# EAGLE design Feuchte-Relais-mit-LCD_v2 (EAGLE 7.4.0)
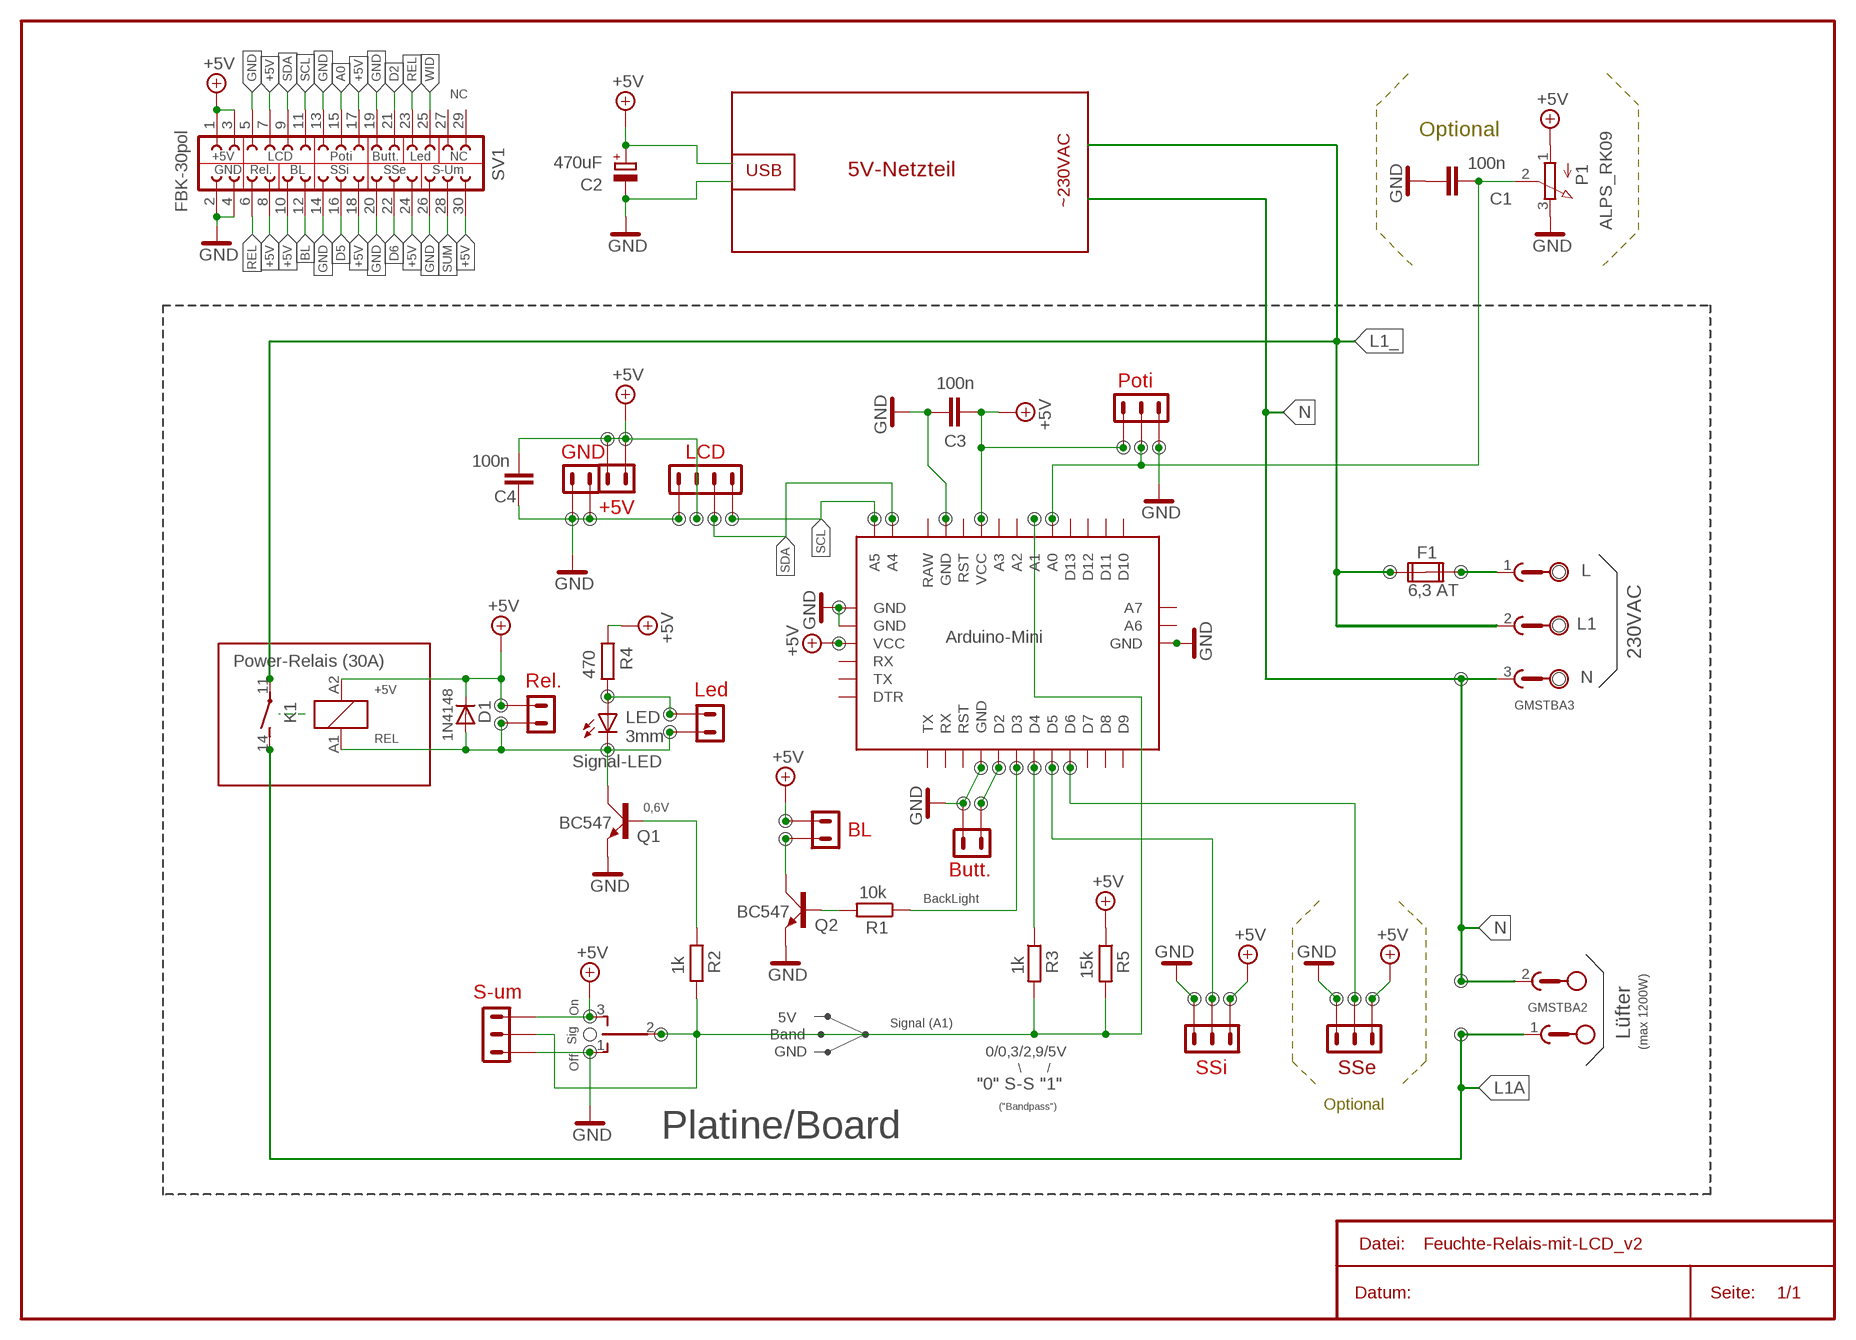
[diagram p0: schematic, sheet 1]

## Parts
230VAC  GMSTBA3  [GMSTBA3]
BOARD  Arduino-Mini  ARDU-MINI  [ARDU-MINI]
C1  100n  C-EU025-024X044  [C025-024X044]
C2  470uF  CPOL-EUE3.5-8  [E3,5-8]
C3  100n  C-EU025-024X044  [C025-024X044]
C4  100n  C-EU025-024X044  [C025-024X044]
D1  1N4148  DIODE-D-2.5  [D-2.5]
F1  6,3 AT  FUSE2P  [FUSE1]
K1  Power-Relais (30A)  ZD322006  [ZD2]
LED1  o3mm  LED3MM  [LED3MM]
LüFTER  GMSTBA2  [GMSTBA2]
P1  ALPS_RK09  [RK09]
Q1  BC547  [SOT54A]
Q2  BC547  [SOT54A]
R1  10k  R-EU_0204/7  [0204/7]
R2  1k  R-EU_0204/2V  [0204V]
R3  1k  R-EU_0204/2V  [0204V]
R4  470  R-EU_0204/2V  [0204V]
R5  15k  R-EU_0204/2V  [0204V]
SUM  TL39PO  [TL3XPO]
SV1  FBK-30pol  FE15-2  [FE15-2]

## Nets
+5V: BOARD.P$21(VCC) BOARD.P$27(VCC) C2.+ C3.1 C4.2 D1.C K1.A2 P1.1(A) R4.1 R5.1 SUM.3(S) SV1.1 SV1.3 SV1.7 SV1.8 SV1.10 SV1.17 SV1.18 SV1.24 SV1.30
A0: BOARD.P$17(A0) C1.2 P1.2(S) SV1.15
A1: BOARD.P$18(A1) R2.1 R3.2 R5.2 SUM.2(P)
BL: Q2.C SV1.12
D2: BOARD.P$5(D2) SV1.21
D3: BOARD.P$6(D3) R1.1
D4: BOARD.P$7(D4) R3.1
D5: BOARD.P$8(D5) SV1.16
D6: BOARD.P$9(D6) SV1.22
GND: BOARD.P$4(GND) BOARD.P$23(GND) BOARD.P$25(GND) BOARD.P$26(GND) BOARD.P$31(GND) C1.1 C2.- C3.2 C4.1 P1.3(E) Q1.E Q2.E SUM.1(O) SV1.2 SV1.4 SV1.5 SV1.13 SV1.14 SV1.19 SV1.20 SV1.26
L: 230VAC.1 F1.2A
L1_: 230VAC.2 F1.1A K1.11(2:P)
L1A: K1.14(2:S) LüFTER.1
N: 230VAC.3 LüFTER.2
N$2: Q1.B R2.2
N$9: Q2.B R1.2
REL: D1.A K1.A1 LED1.K(C) Q1.C SV1.6 SV1.23
SCL: BOARD.P$35(A5) SV1.11
SDA: BOARD.P$34(A4) SV1.9
SUM: SV1.28
WID: LED1.A R4.2 SV1.25
Unconnected: BOARD.P$1(TX) BOARD.P$2(RX) BOARD.P$3(RST) BOARD.P$10(D7) BOARD.P$11(D8) BOARD.P$12(D9) BOARD.P$13(D10) BOARD.P$14(D11) BOARD.P$15(D12) BOARD.P$16(D13) BOARD.P$19(A2) BOARD.P$20(A3) BOARD.P$22(RST) BOARD.P$24(RAW) BOARD.P$28(RX) BOARD.P$29(TX) BOARD.P$30(DTR) BOARD.P$32(A6) BOARD.P$33(A7) F1.1B F1.2B SV1.27 SV1.29

## Notes on the sheet
- NC
- Optional
- +5V | LCD | Poti | Butt. | Led | NC
- GND | Rel. | BL | SSi | SSe | S-Um | USB | 5V-Netzteil
- ~230VAC
- Poti
- GND | LCD
- +5V
- L
- L1
- 230VAC
- Rel. | N
- +5V | Led
- LED
  3mm
- REL
- Signal-LED
- 0,6V
- BL
- Butt.
- BackLight
- S-um
- On
- Signal (A1)
- Lüfter
- Sig
- (max 1200W)
- 5V
  Band
   GND
- 0/0,3/2,9/5V
- Off | SSi | SSe
- "0" S-S "1"
- ("Bandpass") | Optional
- Platine/Board

## Library data of the parts
230VAC = con-phoenix-762:GMSTBA3: PHOENIX; MF: FARNELL; MPN: 1757255; OC_FARNELL: 3705183; OC_NEWARK: 71C4162
BOARD = Arduino-AVR:ARDU-MINI: Arduino Mini Pro Atmega328P Board Modul • Size: (LxWxH) 33x18x3 mm • ATmega328 running at 16MHz with external resonator (0.5% tolerance) • USB connection off board • Supports auto-reset • Max 150mA output • Over current protected • Reverse polarity protected • DC input 5V up to 12V • On board Power and Status LEDs
C1 C3 C4 = rcl1:C-EU: CAPACITOR, European symbol
C2 = rcl1:CPOL-EU: POLARIZED CAPACITOR, European symbol
D1 = diode1:DIODE-: DIODE
F1 = special:FUSE2P: FUSE 5 x 20 mm
K1 = relay:ZD?2*: Power Relay SCHRACK 1 pole 30 A Source: http://www.schrack.com/.. 5848.pdf; OC_FARNELL: unknown; OC_NEWARK: unknown
LED1 = led:LED: LED OSRAM: - CHIPLED LG R971, LG N971, LY N971, LG Q971, LY Q971, LO R971, LY R971 LH N974, LH R974 LS Q976, LO Q976, LY Q976 LO Q996 - Hyper CHIPLED LW Q18S LB Q993, LB Q99A, LB R99A - SideLED LS A670, LO A670, LY A670, LG A670, LP A670 LB A673, LV A673, LT A673, LW A673 LH A674 LY A675 LS A676, LA A676, LO A676, LY A676, LW A676 LS A679, LY A679, LG A679 - Hyper Micro SIDELED® LS Y876, LA Y876, LO Y876, LY Y876 LT Y87S - SmartLED LW L88C, LW L88S LB L89C, LB L89S, LG L890 LS L89K, LO L89K, LY L89K LS L896, LA L896, LO L896, LY L896 - TOPLED LS T670, LO T670, LY T670, LG T670, LP T670 LSG T670, LSP T670, LSY T670, LOP T670, LYG T670 LG T671, LOG T671, LSG T671 LB T673, LV T673, LT T673, LW T673 LH T674 LS T676, LA T676, LO T676, LY T676, LB T676, LH T676, LSB T676, LW T676 LB T67C, LV T67C, LT T67C, LS T67K, LO T67K, LY T67K, LW E67C LS E67B, LA E67B, LO E67B, LY E67B, LB E67C, LV E67C, LT E67C LW T67C LS T679, LY T679, LG T679 LS T770, LO T770, LY T770, LG T770, LP T770 LB T773, LV T773, LT T773, LW T773 LH T774 LS E675, LA E675, LY E675, LS T675 LS T776, LA T776, LO T776, LY T776, LB T776 LHGB T686 LT T68C, LB T68C - Hyper Mini TOPLED® LB M676 - Mini TOPLED Santana® LG M470 LS M47K, LO M47K, LY M47K Source: http://www.osram.convergy.de LUXEON: - LUMILED® LXK2-PW12-R00, LXK2-PW12-S00, LXK2-PW14-U00, LXK2-PW14-V00 LXK2-PM12-R00, LXK2-PM12-S00, LXK2-PM14-U00 LXK2-PE12-Q00, LXK2-PE12-R00, LXK2-PE12-S00, LXK2-PE14-T00, LXK2-PE14-U00 LXK2-PB12-K00, LXK2-PB12-L00, LXK2-PB12-M00, LXK2-PB14-N00, LXK2-PB14-P00, LXK2-PB14-Q00 LXK2-PR12-L00, LXK2-PR12-M00, LXK2-PR14-Q00, LXK2-PR14-R00 LXK2-PD12-Q00, LXK2-PD12-R00, LXK2-PD12-S00 LXK2-PH12-R00, LXK2-PH12-S00 LXK2-PL12-P00, LXK2-PL12-Q00, LXK2-PL12-R00 Source: www.luxeon.com KINGBRIGHT: KA-3528ASYC Source: www.kingbright.com
LüFTER = con-phoenix-762:GMSTBA2: PHOENIX; MF: FARNELL; MPN: 1757242; OC_FARNELL: 3705171; OC_NEWARK: 71C4161
P1 = pot:ALPS_RK09: ALPS Drehpotentiometer "RK09 Series" TH-Montage senkrecht auf der Platine, Maße: 10x11mm, ø6mm * L:17,4mm Farnell-Nr: 1191725 (10k-Poti)
Q1 Q2 = transistor-small-signal:BC547: NPN TRANSISTOR
R1-R5 = rcl1:R-EU_: RESISTOR, European symbol
SUM = switch:TL39PO: TINY SWITCH ON OFF ON Source: http://www2.produktinfo.conrad.com/datenblaetter/700000-724999/705152-da-01-de-Subminiaturschalter_TL_36YO.pdf
SV1 = con-lsta:FE15-2: FEMALE HEADER; OC_FARNELL: unknown; OC_NEWARK: unknown

## Board
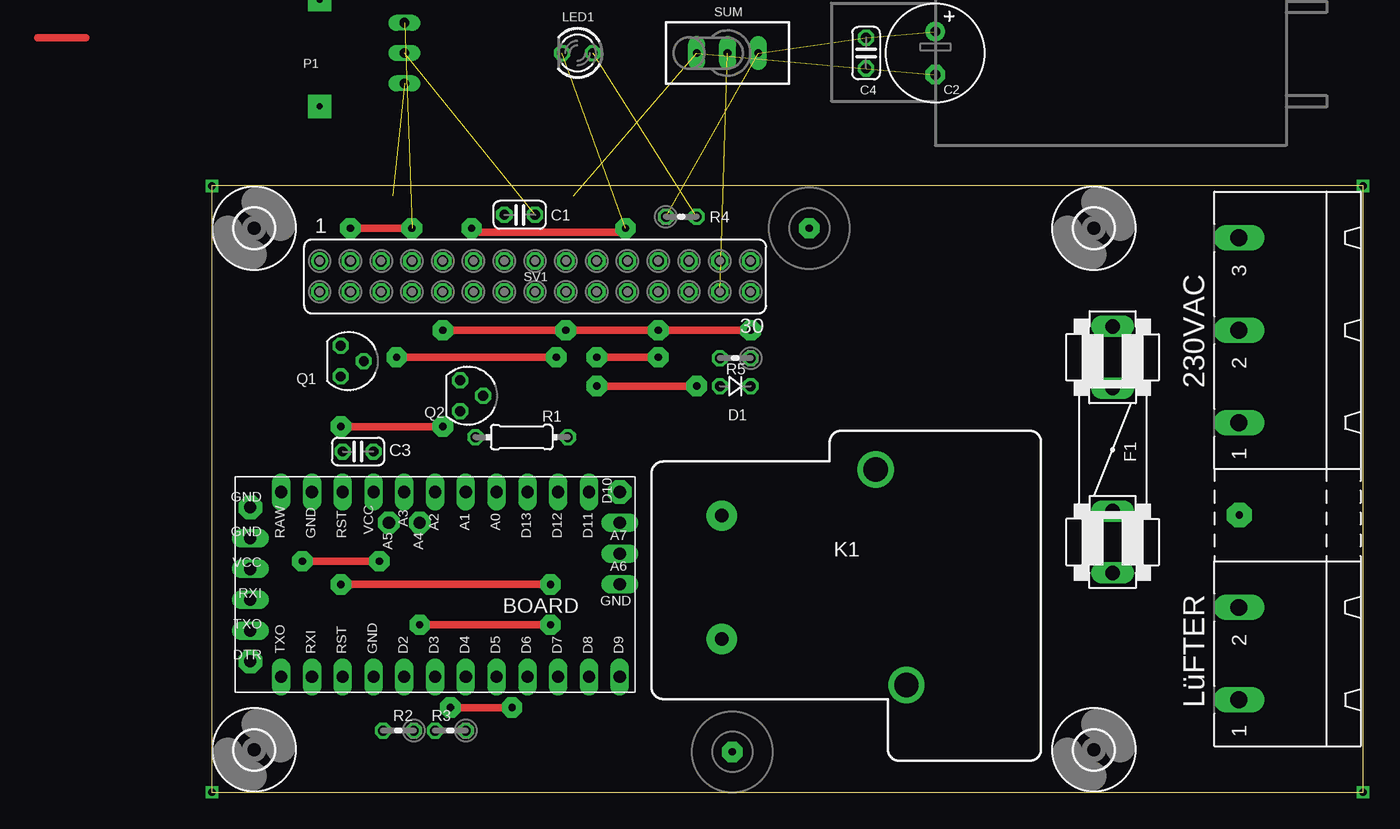
[diagram p1: board, top side]
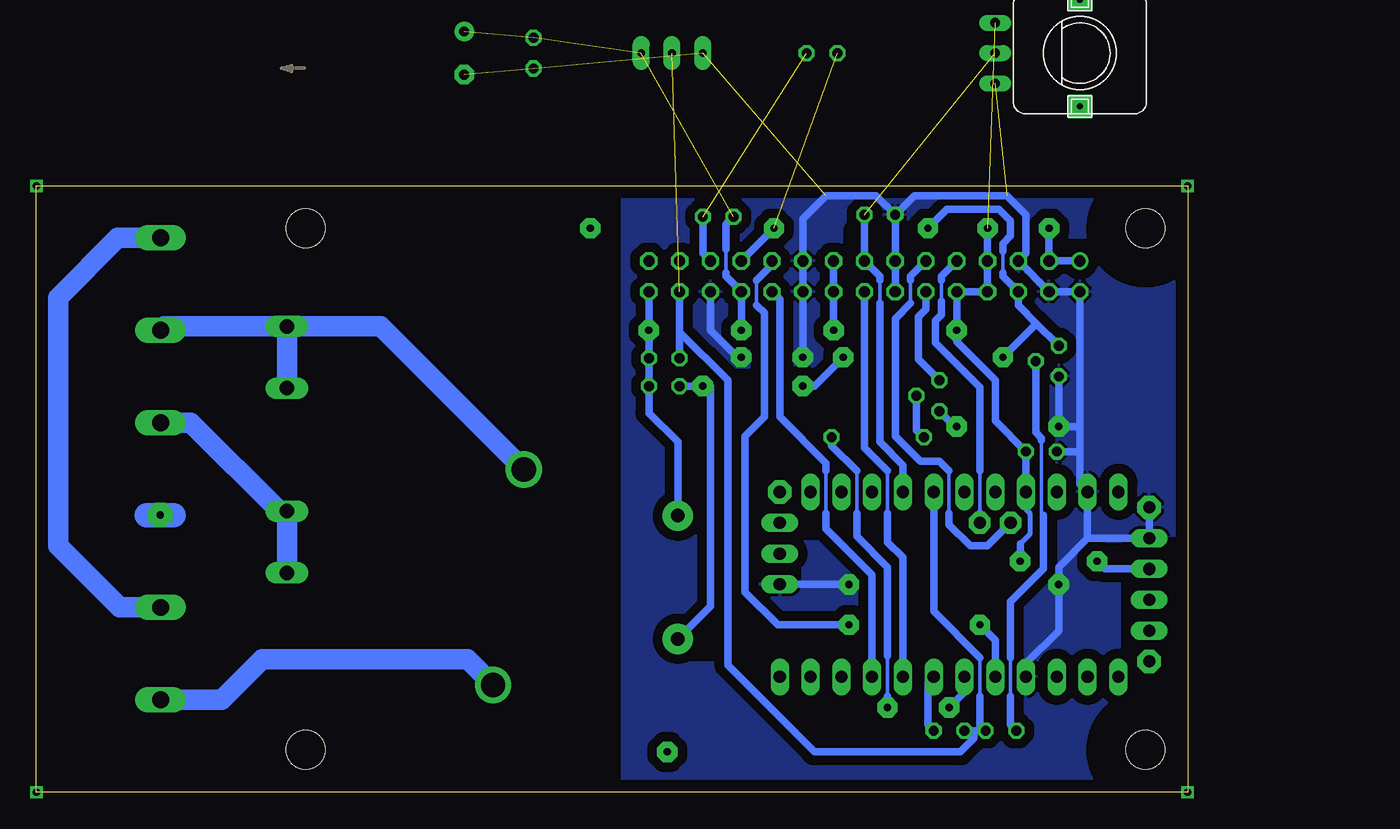
[diagram p2: board, bottom side, seen from below]

Size 95 x 50 mm. Coordinates in mm from the lower left corner, seen from the top.
Outline: 0,0 95,0 95,50 0,50 0,0
Copper layers (1*16): Top 0.035mm / dielectric 1.5mm / Bottom 0.035mm
Design rules "default": minimum track width 10mil, minimum drill 24mil, track to track 8mil, track to pad 8mil, pad to pad 8mil, via to via 8mil, smd to smd 8mil, copper to edge 40mil, drill to drill 8mil, minimum pad ring 10mil, minimum via ring 8mil, stop-mask expansion 4mil, vias tented up to drill 0mil, thermal gap 10mil
bRestrict: area 18.1,27.4 to 21.2,33.6; area 22,43.2 to 27.6,46.4; area 0.8,11 to 4.7,20.2; area 30,21.6 to 32.5,22.9; area 8.1,44.1 to 14.2,44.9; area 38,11.6 to 42,13.7; area 36.2,32.3 to 37.4,34.1; area 4.5,18.4 to 6.9,19.8; area 32.7,17.5 to 34.1,20

### Footprints (pad centres in the part's own frame; a part is rotated, then mirrored left to right if it is on the bottom)
GMSTBA3 = drill 1.397 long: 1 -7.62,5.08; 2 0,5.08; 3 7.62,5.08
ARDU-MINI = drill 1 pad 1.524 long: P$1 -6.35,11.43; P$2 -6.35,8.89; P$3 -6.35,6.35; P$4 -6.35,3.81; P$5 -6.35,1.27; P$6 -6.35,-1.27; P$7 -6.35,-3.81; P$8 -6.35,-6.35; P$9 -6.35,-8.89; P$10 -6.35,-11.43; P$11 -6.35,-13.97; P$12 -6.35,-16.51; P$14 8.89,-13.97; P$15 8.89,-11.43; P$16 8.89,-8.89; P$17 8.89,-6.35; P$18 8.89,-3.81; P$19 8.89,-1.27; P$20 8.89,1.27; P$21 8.89,3.81; P$22 8.89,6.35; P$23 8.89,8.89; P$24 8.89,11.43; P$26 5.08,13.97; P$27 2.54,13.97; P$28 0,13.97; P$29 -2.54,13.97; P$31 1.27,-16.51; P$32 3.81,-16.51; P$33 6.35,-16.51 | drill 1 pad 1.93 octagon: P$13 8.89,-16.51; P$25 7.62,13.97; P$30 -5.08,13.97 | drill 1 pad 1.778 octagon: P$34 6.35,0; P$35 6.35,2.54
C025-024X044 = drill 0.813 octagon: 1 -1.27,0; 2 1.27,0
E3,5-8 = drill 0.813 pad 1.6: + -1.778,0 | drill 0.813 pad 1.6 octagon: - 1.778,0
D-2.5 = drill 0.813 octagon: A 1.27,0; C -1.27,0
FUSE1 = drill 1.194 long: 1A -10.16,0; 1B -5.08,0; 2A 10.16,0; 2B 5.08,0
ZD2 = drill 2 pad 2.5: 11 -2.54,-8.88; 14 -5.08,8.88 | drill 1.1 pad 2.5: A1 10.16,5.08; A2 10.16,-5.08
LED3MM = drill 0.813 octagon: A -1.27,0; K 1.27,0
GMSTBA2 = drill 1.397 long: 1 -3.81,5.08; 2 3.81,5.08
RK09 = drill 0.8 long: 1 -2.5,-7; 2 0,-7; 3 2.5,-7 | drill 0.5 pad 1.93 square: GND@1 -4.4,0; GND@2 4.4,0
SOT54A = drill 0.813 octagon: B 0,1.27; C -1.27,-0.635; E 1.27,-0.635
0204/7 = drill 0.813 octagon: 1 -3.81,0; 2 3.81,0
0204V = drill 0.813 octagon: 1 -1.27,0; 2 1.27,0
TL3XPO = drill 0.635 pad 1.422 long: 1 -2.54,0; 2 0,0; 3 2.54,0
FE15-2 = drill 0.914: 1 -17.78,1.27 | drill 0.914 octagon: 2 -17.78,-1.27; 3 -15.24,1.27; 4 -15.24,-1.27; 5 -12.7,1.27; 6 -12.7,-1.27; 7 -10.16,1.27; 8 -10.16,-1.27; 9 -7.62,1.27; 10 -7.62,-1.27; 11 -5.08,1.27; 12 -5.08,-1.27; 13 -2.54,1.27; 14 -2.54,-1.27; 15 0,1.27; 16 0,-1.27; 17 2.54,1.27; 18 2.54,-1.27; 19 5.08,1.27; 20 5.08,-1.27; 21 7.62,1.27; 22 7.62,-1.27; 23 10.16,1.27; 24 10.16,-1.27; 25 12.7,1.27; 26 12.7,-1.27; 27 15.24,1.27; 28 15.24,-1.27; 29 17.78,1.27; 30 17.78,-1.27
3,2 = hole 3.2: 0,0

### Placement (x,y rotation side)
230VAC  89.82,38.1 90 top
BOARD  17.14,15.88 90 top
C1  25.4,47.62 0 top
C2  59.69,60.96 270 top  (outside the outline)
C3  12.06,28.1 180 top
C4  53.98,60.96 90 top  (outside the outline)
D1  43.18,33.5 180 top
F1  74.31,28.26 270 top
K1  52.23,17.73 180 top
LED1  30.16,60.96 180 top  (outside the outline)
LüFTER  89.82,11.43 90 top
P1  8.89,60.96 270 bottom  (outside the outline)
Q1  11.27,35.56 270 top
Q2  21.11,32.7 270 top
R1  25.56,29.29 180 top
R2  15.4,5.08 180 top
R3  19.68,5.08 180 top
R4  38.73,47.47 0 top
R5  43.18,35.8 180 top
SUM  42.55,60.96 0 top  (outside the outline)
SV1  26.67,42.55 0 top
U$1  [3,2]  72.77,3.49 0 top
U$2  [3,2]  72.77,46.51 0 top
U$3  [3,2]  3.49,46.51 0 top
U$4  [3,2]  3.49,3.49 0 top

### Tracks (layer width: path | path; a pad name or v marks a point on that pad's centre or on a via)
+5V  (via drill 0.6 pad 1.68)  (4 unrouted)
  Top 0.61: v11.43,46.51 v16.51,46.51 | v44.45,38.1 v36.83,38.1 v29.21,38.1 v19.05,38.1 | v13.81,19.05 v7.46,19.05
  Bottom 0.305: 38.1,44.77 38.1,42.86
  Bottom 0.406: BOARD.P$21 13.34,23.34 13.02,23.02 13.02,21.27 13.81,20.48
  Bottom 0.61: SV1.1 SV1.3 v11.43,46.51 | v16.51,46.51 SV1.7 SV1.8 SV1.10 v19.05,38.1 19.05,37.15 15.88,33.97 15.88,30.64 C3.1 BOARD.P$21 | SV1.30 v44.45,38.1 R5.1 D1.C 44.45,31.27 42.07,28.89 K1.A2 | v36.83,38.1 SV1.24 38.1,42.55 38.1,42.86 | SV1.17 SV1.18 v29.21,38.1 | R4.1 38.1,46.83 38.1,44.77 | 13.81,20.48 v13.81,19.05 | v7.46,19.05 6.83,18.41 BOARD.P$27
A0  (1 unrouted)
  Bottom 0.305: 25.4,42.23 25.4,40.32
  Bottom 0.61: 25.4,42.23 25.4,42.55 SV1.15 C1.2 | 25.4,40.32 25.4,28.89 23.5,26.99 BOARD.P$17
A1  (1 unrouted)
  Bottom 0.305: 17.14,7.94 17.14,11.11
  Bottom 0.61: 17.14,5.08 R2.1 | 17.14,11.11 20.95,14.92 BOARD.P$18 | 17.14,7.94 17.14,5.08 | 41.91,37.94 37.94,33.97 37.94,10.48 30.8,3.33 18.73,3.33 17.62,4.45 17.62,5.08 | 41.91,37.94 41.91,41.27 | 41.91,37.94 R5.2 | R3.2 17.62,5.08 | 17.62,5.08 17.14,5.08
BL
  Bottom 0.61: SV1.12 21.59,39.85 22.23,39.21 22.23,35.72 Q2.C
D2  (via drill 0.6 pad 1.68)
  Top 0.61: v17.14,13.81 v27.94,13.81
  Bottom 0.305: 35.56,40.16 35.56,42.23
  Bottom 0.61: BOARD.P$5 15.88,12.54 v17.14,13.81 | v27.94,13.81 33.81,13.81 36.51,16.51 36.51,29.37 34.92,30.96 34.92,39.53 35.56,40.16 | 35.56,42.23 34.29,43.5 SV1.21
D3  (via drill 0.6 pad 1.68)
  Top 0.61: v19.68,6.99 v24.77,6.99
  Bottom 0.305: 27.3,26.51 27.3,23.02 | 24.77,11.27 24.77,7.94
  Bottom 0.61: R1.1 29.37,28.57 27.3,26.51 | 27.3,23.02 27.3,21.11 24.77,18.57 24.77,11.27 | BOARD.P$6 18.41,8.26 v19.68,6.99 | 24.77,7.94 v24.77,6.99
D4
  Bottom 0.61: BOARD.P$7 21.43,9.05 21.43,5.56 R3.1
D5
  Bottom 0.305: 24.77,26.51 24.77,23.02
  Bottom 0.61: SV1.16 26.67,28.42 24.77,26.51 | 24.77,23.02 24.77,20.64 23.5,19.37 BOARD.P$8
D6
  Bottom 0.305: 29.84,23.02 29.84,26.51
  Bottom 0.61: BOARD.P$9 26.04,17.94 29.84,21.75 29.84,23.02 | 29.84,26.51 29.84,27.15 33.66,30.96 33.66,40.64 SV1.22
GND  (via drill 0.6 pad 1.68)  (4 unrouted)
  Top 0.61: v19.05,30.16 v10.64,30.16 | v36.83,35.88 v31.75,35.88 | v27.94,17.14 v10.64,17.14
  Bottom 0.61: 8.89,30.16 SV1.2 SV1.4 SV1.5 13.34,44.45 13.34,47.62 14.92,49.21 22.54,49.21 C1.1 | 8.89,30.16 8.89,28.1 | 8.89,28.1 8.89,25.4 BOARD.P$23 8.26,20.96 | SV1.14 SV1.13 C1.1 | C1.1 25.72,49.21 29.84,49.21 31.75,47.31 SV1.19 SV1.20 v31.75,35.88 | BOARD.P$25 BOARD.P$26 8.26,20.96 | C3.2 8.89,28.1 | 8.89,30.16 v10.64,30.16 Q1.E | v19.05,30.16 19.21,30.16 Q2.E | v36.83,35.88 37.15,35.88 39.37,38.1 SV1.26 | BOARD.P$4 13.34,10.64 10.64,13.34 v10.64,17.14 10.64,18.57 8.26,20.96 | BOARD.P$31 28.73,17.15 v27.94,17.14
  pour Bottom (isolate 0.813): -0.64,50.48 46.67,50.48 46.67,-0.64 -0.64,-0.64
L
  Bottom 1.676: F1.2A 74.31,23.16 74.93,23.18 82.23,30.48 230VAC.1
L1_
  Bottom 1.676: 230VAC.2 84.42,38.42 F1.1A | K1.11 66.57,38.42 F1.1A | F1.1A 74.31,33.34
L1A
  Bottom 1.676: LüFTER.1 79.69,7.62 76.36,10.95 59.41,10.95 K1.14
N
  Bottom 1.676: 230VAC.3 88.27,45.72 93.19,40.8 93.19,20.32 88.11,15.24 LüFTER.2
N$1  (via drill 0.6 pad 1.68)
  other vias: 3.49,46.51
N$2
  Bottom 0.305: 14.61,7.94 14.61,11.11 | 12.06,29.05 12.06,22.86 11.91,22.86
  Bottom 0.61: R2.2 14.61,5.56 14.61,7.94 | 14.61,11.11 14.61,15.72 11.91,18.41 11.91,22.86 | 12.06,29.05 12.06,29.21 12.54,29.69 Q1.B
N$3  (via drill 0.6)
  other vias: 0,0
N$4  (via drill 0.6 pad 1.68)
  other vias: 42.94,3.33
N$5  (via drill 0.6 pad 1.68)
  other vias: 3.49,3.49
N$6  (via drill 0.6 pad 1.68)
  other vias: 72.77,3.49
N$8  (via drill 0.6 pad 1.68)
  other vias: 49.29,46.51
N$9
  Bottom 0.61: Q2.B 22.38,29.84 R1.2
N$10  (via drill 0.6 pad 2.03)
  Bottom 2.032: 85.88,22.86 v84.77,22.86 83.66,22.86
N$11  (via drill 0.6)
  other vias: 0,50.01
N$12  (via drill 0.6)
  other vias: 94.98,50.01
N$13  (via drill 0.6)
  other vias: 94.98,0
N$14
  Top 0.61: -14.37,62.23 -10.4,62.23
N$19  (via drill 0.6 pad 1.68)
  other vias: 72.77,46.51
REL  (via drill 0.6 pad 1.68)  (1 unrouted)
  Top 0.61: v21.43,46.51 21.75,46.2 33.81,46.2 v34.13,46.51 | v28.42,35.88 v15.24,35.88 | v31.75,33.5 v40.01,33.5
  Bottom 0.305: 15.24,42.86 15.24,44.61
  Bottom 0.61: 15.24,42.86 15.24,42.55 SV1.6 13.97,40.16 12.46,38.66 | 15.24,44.61 15.24,45.24 14.61,45.88 14.61,47.15 15.56,48.1 19.84,48.1 v21.43,46.51 | v34.13,46.51 SV1.23 | 12.46,38.66 Q1.C | v15.24,35.88 12.46,38.66 | v28.42,35.88 30.8,33.5 v31.75,33.5 | K1.A1 39.37,15.35 39.37,33.5 v40.01,33.5 D1.A
SCL
  Bottom 0.305: 22.86,42.23 22.86,40.32 | 19.68,26.51 19.68,23.02
  Bottom 0.61: SV1.11 22.86,42.55 22.86,42.23 | 22.86,40.32 24.13,39.05 24.13,29.37 22.07,27.3 20.48,27.3 19.68,26.51 | 19.68,23.02 19.68,22.07 17.94,20.32 16.51,20.32 BOARD.P$35
SDA
  Bottom 0.305: 17.14,23.02 17.14,26.51 | 20.32,42.23 20.32,40.48
  Bottom 0.61: BOARD.P$34 17.14,23.02 | SV1.9 20.32,42.55 20.32,42.23 | 20.32,40.48 20.32,39.37 20.8,38.89 20.8,37.07 17.14,33.42 17.14,26.51
WID  (1 unrouted)
  Bottom 0.61: R4.2 40.01,44.45 SV1.25

### Text on the board
tValues: Cables: | High Voltage! | Low Voltage | +5V | Bridges: 0,5mm W. | +5V | Netzteil | 10k | Vias: 0,5mm-Wire | +5V | 230 +5V | GND | +5V | GND | 23VAC | TH-Wires 0,5mm | GND | Connectors | N | +5V | LCD | Poti | Butt. | Led | L1a | GND | Rel. | BL | SSi | S-Um | +5V | GND | L1 | +5V | N | Rel | L1r
bValues: NC | SSe
Measures: o3mm
Muster: Poti Butt. LED S-Um